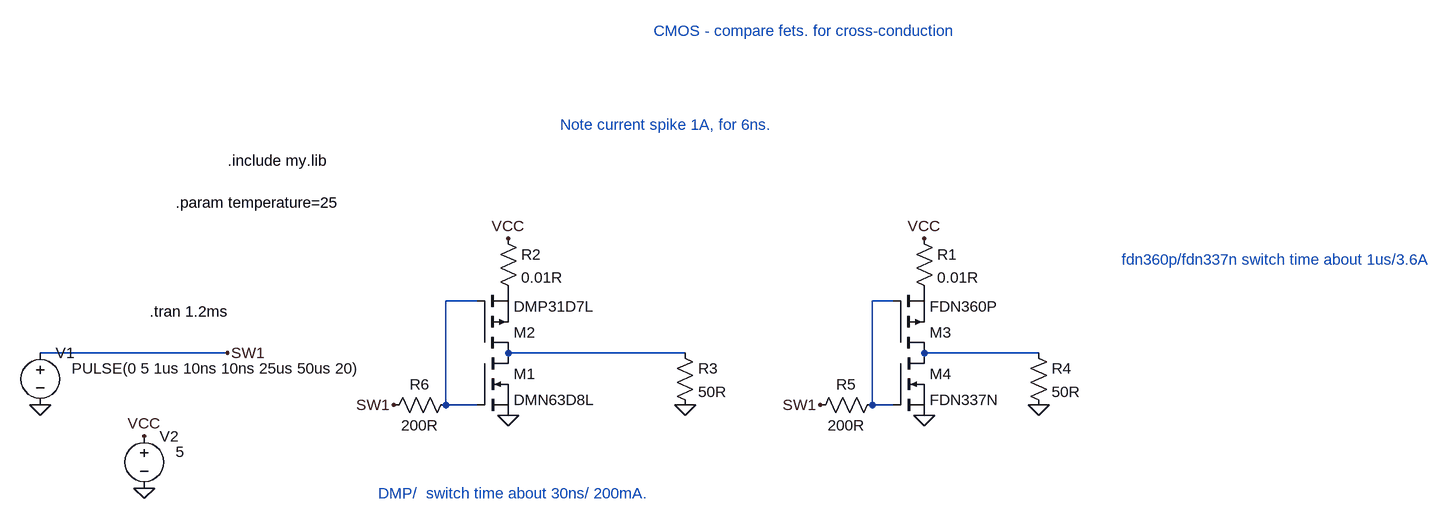
[diagram p0: schematic Draft81.asc]
Draft81.asc, the LTspice schematic file:
Version 4
SHEET 1 4244 1268
WIRE 896 -304 848 -304
WIRE 1536 -304 1504 -304
WIRE 512 -224 224 -224
WIRE 1216 -224 944 -224
WIRE 1760 -224 1584 -224
WIRE 848 -144 848 -304
WIRE 896 -144 848 -144
WIRE 1504 -144 1504 -304
WIRE 1536 -144 1504 -144
FLAG 384 -16 0
FLAG 384 -96 VCC
FLAG 224 -144 0
FLAG 512 -224 SW1
FLAG 944 -400 VCC
FLAG 944 -128 0
FLAG 768 -144 SW1
FLAG 1216 -144 0
FLAG 1584 -400 VCC
FLAG 1424 -144 SW1
FLAG 1584 -128 0
FLAG 1760 -144 0
SYMBOL voltage 384 -112 R0
WINDOW 123 0 0 Left 0
WINDOW 39 0 0 Left 0
WINDOW 3 48 40 Left 2
SYMATTR Value 5
SYMATTR InstName V2
SYMBOL voltage 224 -240 R0
WINDOW 123 0 0 Left 0
WINDOW 39 0 0 Left 0
WINDOW 3 48 40 Left 2
SYMATTR Value PULSE(0 5 1us 10ns 10ns 25us 50us 20)
SYMATTR InstName V1
SYMBOL pmos 896 -224 M180
SYMATTR InstName M2
SYMATTR Value DMP31D7L
SYMATTR Prefix X
SYMBOL res 928 -416 R0
SYMATTR InstName R2
SYMATTR Value 0.01R
SYMBOL nmos 896 -224 R0
SYMATTR InstName M1
SYMATTR Value DMN63D8L
SYMATTR Prefix X
SYMBOL res 1200 -240 R0
SYMATTR InstName R3
SYMATTR Value 50R
SYMBOL pmos 1536 -224 M180
SYMATTR InstName M3
SYMATTR Value FDN360P
SYMATTR Prefix X
SYMATTR Value2 VTEMP=30
SYMBOL res 1568 -416 R0
SYMATTR InstName R1
SYMATTR Value 0.01R
SYMBOL nmos 1536 -224 R0
SYMATTR InstName M4
SYMATTR Value FDN337N
SYMATTR Prefix X
SYMBOL res 1744 -240 R0
SYMATTR InstName R4
SYMATTR Value 50R
SYMBOL res 1520 -160 R90
WINDOW 0 0 56 VBottom 2
WINDOW 3 32 56 VTop 2
SYMATTR InstName R5
SYMATTR Value 200R
SYMBOL res 864 -160 R90
WINDOW 0 0 56 VBottom 2
WINDOW 3 32 56 VTop 2
SYMATTR InstName R6
SYMATTR Value 200R
TEXT 392 -288 Left 2 !.tran 1.2ms
TEXT 512 -520 Left 2 !.include my.lib
TEXT 1024 -576 Left 2 ;Note current spike 1A, for 6ns.
TEXT 432 -456 Left 2 !.param temperature=25
TEXT 1888 -368 Left 2 ;fdn360p/fdn337n switch time about 1us/3.6A
TEXT 744 -8 Left 2 ;DMP/  switch time about 30ns/ 200mA.
TEXT 1168 -720 Left 2 ;CMOS - compare fets. for cross-conduction

The netlist it stands for:
* Draft81.asc
V2 VCC 0 5
V1 SW1 0 PULSE(0 5 1us 10ns 10ns 25us 50us 20)
XM2 N003 N001 P001 DMP31D7L  ; pins D G S
R2 VCC P001 0.01R
XM1 N003 N001 0 DMN63D8L  ; pins D G S
R3 N003 0 50R
XM3 N004 N002 P002 FDN360P VTEMP=30  ; pins D G S
R1 VCC P002 0.01R
XM4 N004 N002 0 FDN337N  ; pins D G S
R4 N004 0 50R
R5 N002 SW1 200R
R6 N001 SW1 200R
.tran 1.2ms
.include my.lib
* Note current spike 1A, for 6ns.
.param temperature=25
* fdn360p/fdn337n switch time about 1us/3.6A
* DMP/  switch time about 30ns/ 200mA.
* CMOS - compare fets. for cross-conduction
.backanno
.end